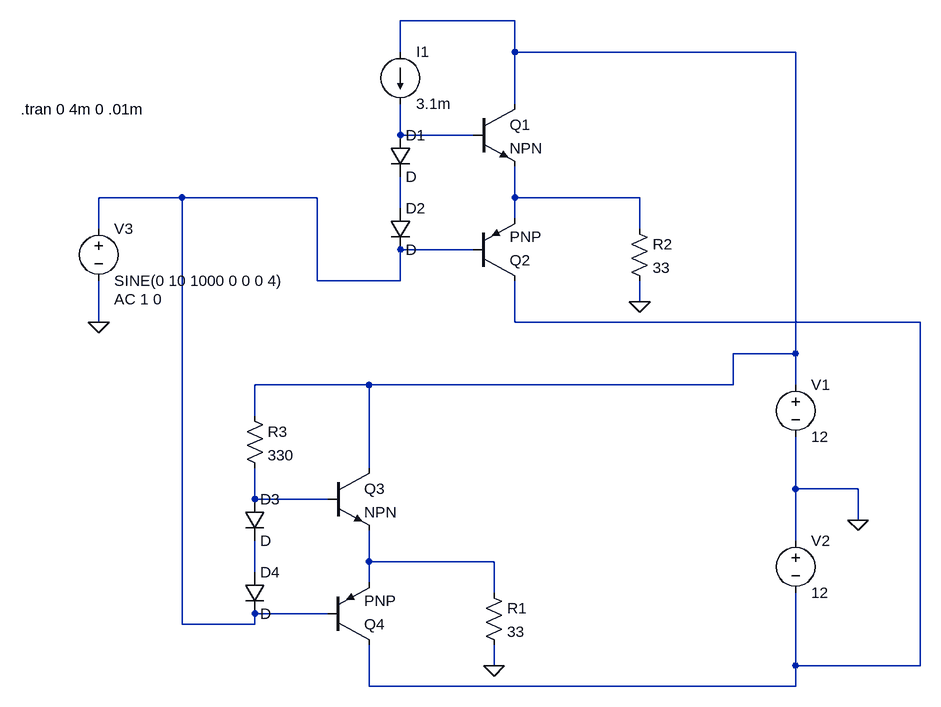
[diagram p0: schematic claseab7.asc]
claseab7.asc, the LTspice schematic file:
Version 4
SHEET 1 884 680
WIRE 256 -560 80 -560
WIRE 80 -512 80 -560
WIRE 256 -512 256 -560
WIRE 688 -512 256 -512
WIRE 256 -432 256 -512
WIRE 80 -384 80 -432
WIRE 192 -384 80 -384
WIRE -256 -288 -384 -288
WIRE -48 -288 -256 -288
WIRE 256 -288 256 -336
WIRE 448 -288 256 -288
WIRE 80 -272 80 -320
WIRE 256 -256 256 -288
WIRE -384 -240 -384 -288
WIRE 448 -240 448 -288
WIRE 192 -208 80 -208
WIRE -48 -160 -48 -288
WIRE 80 -160 80 -208
WIRE 80 -160 -48 -160
WIRE 448 -128 448 -160
WIRE -384 -96 -384 -160
WIRE 256 -96 256 -160
WIRE 880 -96 256 -96
WIRE 688 -48 688 -512
WIRE 688 -48 592 -48
WIRE 32 0 -144 0
WIRE 592 0 592 -48
WIRE 592 0 32 0
WIRE 688 0 688 -48
WIRE -144 48 -144 0
WIRE 32 128 32 0
WIRE 688 160 688 80
WIRE 784 160 688 160
WIRE -144 176 -144 128
WIRE -32 176 -144 176
WIRE 784 208 784 160
WIRE 688 240 688 160
WIRE 32 272 32 224
WIRE 224 272 32 272
WIRE -144 288 -144 240
WIRE 32 304 32 272
WIRE 224 320 224 272
WIRE -32 352 -144 352
WIRE -256 368 -256 -288
WIRE -144 368 -144 352
WIRE -144 368 -256 368
WIRE 224 432 224 400
WIRE 688 432 688 320
WIRE 880 432 880 -96
WIRE 880 432 688 432
WIRE 32 464 32 400
WIRE 688 464 688 432
WIRE 688 464 32 464
FLAG 784 208 0
FLAG -384 -96 0
FLAG 448 -128 0
FLAG 224 432 0
SYMBOL voltage 688 -16 R0
WINDOW 123 0 0 Left 2
WINDOW 39 0 0 Left 2
SYMATTR InstName V1
SYMATTR Value 12
SYMBOL voltage 688 224 R0
WINDOW 123 0 0 Left 2
WINDOW 39 0 0 Left 2
SYMATTR InstName V2
SYMATTR Value 12
SYMBOL voltage -384 -256 R0
WINDOW 123 24 124 Left 2
WINDOW 39 0 0 Left 2
SYMATTR Value2 AC 1 0
SYMATTR InstName V3
SYMATTR Value SINE(0 10 1000 0 0 0 4)
SYMBOL diode 64 -384 R0
SYMATTR InstName D1
SYMBOL diode 64 -272 R0
SYMATTR InstName D2
SYMBOL res 432 -256 R0
SYMATTR InstName R2
SYMATTR Value 33
SYMBOL current 80 -512 R0
WINDOW 123 0 0 Left 2
WINDOW 39 0 0 Left 2
SYMATTR InstName I1
SYMATTR Value 3.1m
SYMBOL npn 192 -432 R0
SYMATTR InstName Q1
SYMBOL pnp 192 -160 M180
SYMATTR InstName Q2
SYMBOL diode -160 176 R0
SYMATTR InstName D3
SYMBOL diode -160 288 R0
SYMATTR InstName D4
SYMBOL res 208 304 R0
SYMATTR InstName R1
SYMATTR Value 33
SYMBOL npn -32 128 R0
SYMATTR InstName Q3
SYMBOL pnp -32 400 M180
SYMATTR InstName Q4
SYMBOL res -160 32 R0
SYMATTR InstName R3
SYMATTR Value 330
TEXT -504 -424 Left 2 !.tran 0 4m 0 .01m

The netlist it stands for:
* claseab7.asc
V1 N001 0 12
V2 0 N006 12
V3 N003 0 SINE(0 10 1000 0 0 0 4) AC 1 0
D1 N002 N005 D
D2 N005 N003 D
R2 N004 0 33
I1 N001 N002 3.1m
Q1 N001 N002 N004 0 NPN
Q2 N006 N003 N004 0 PNP
D3 N007 N009 D
D4 N009 N003 D
R1 N008 0 33
Q3 N001 N007 N008 0 NPN
Q4 N006 N003 N008 0 PNP
R3 N001 N007 330
.model D D
.lib standard.dio
.model NPN NPN
.model PNP PNP
.lib standard.bjt
.tran 0 4m 0 .01m
.backanno
.end